# EAGLE design 2te40ut (EAGLE 4.16)
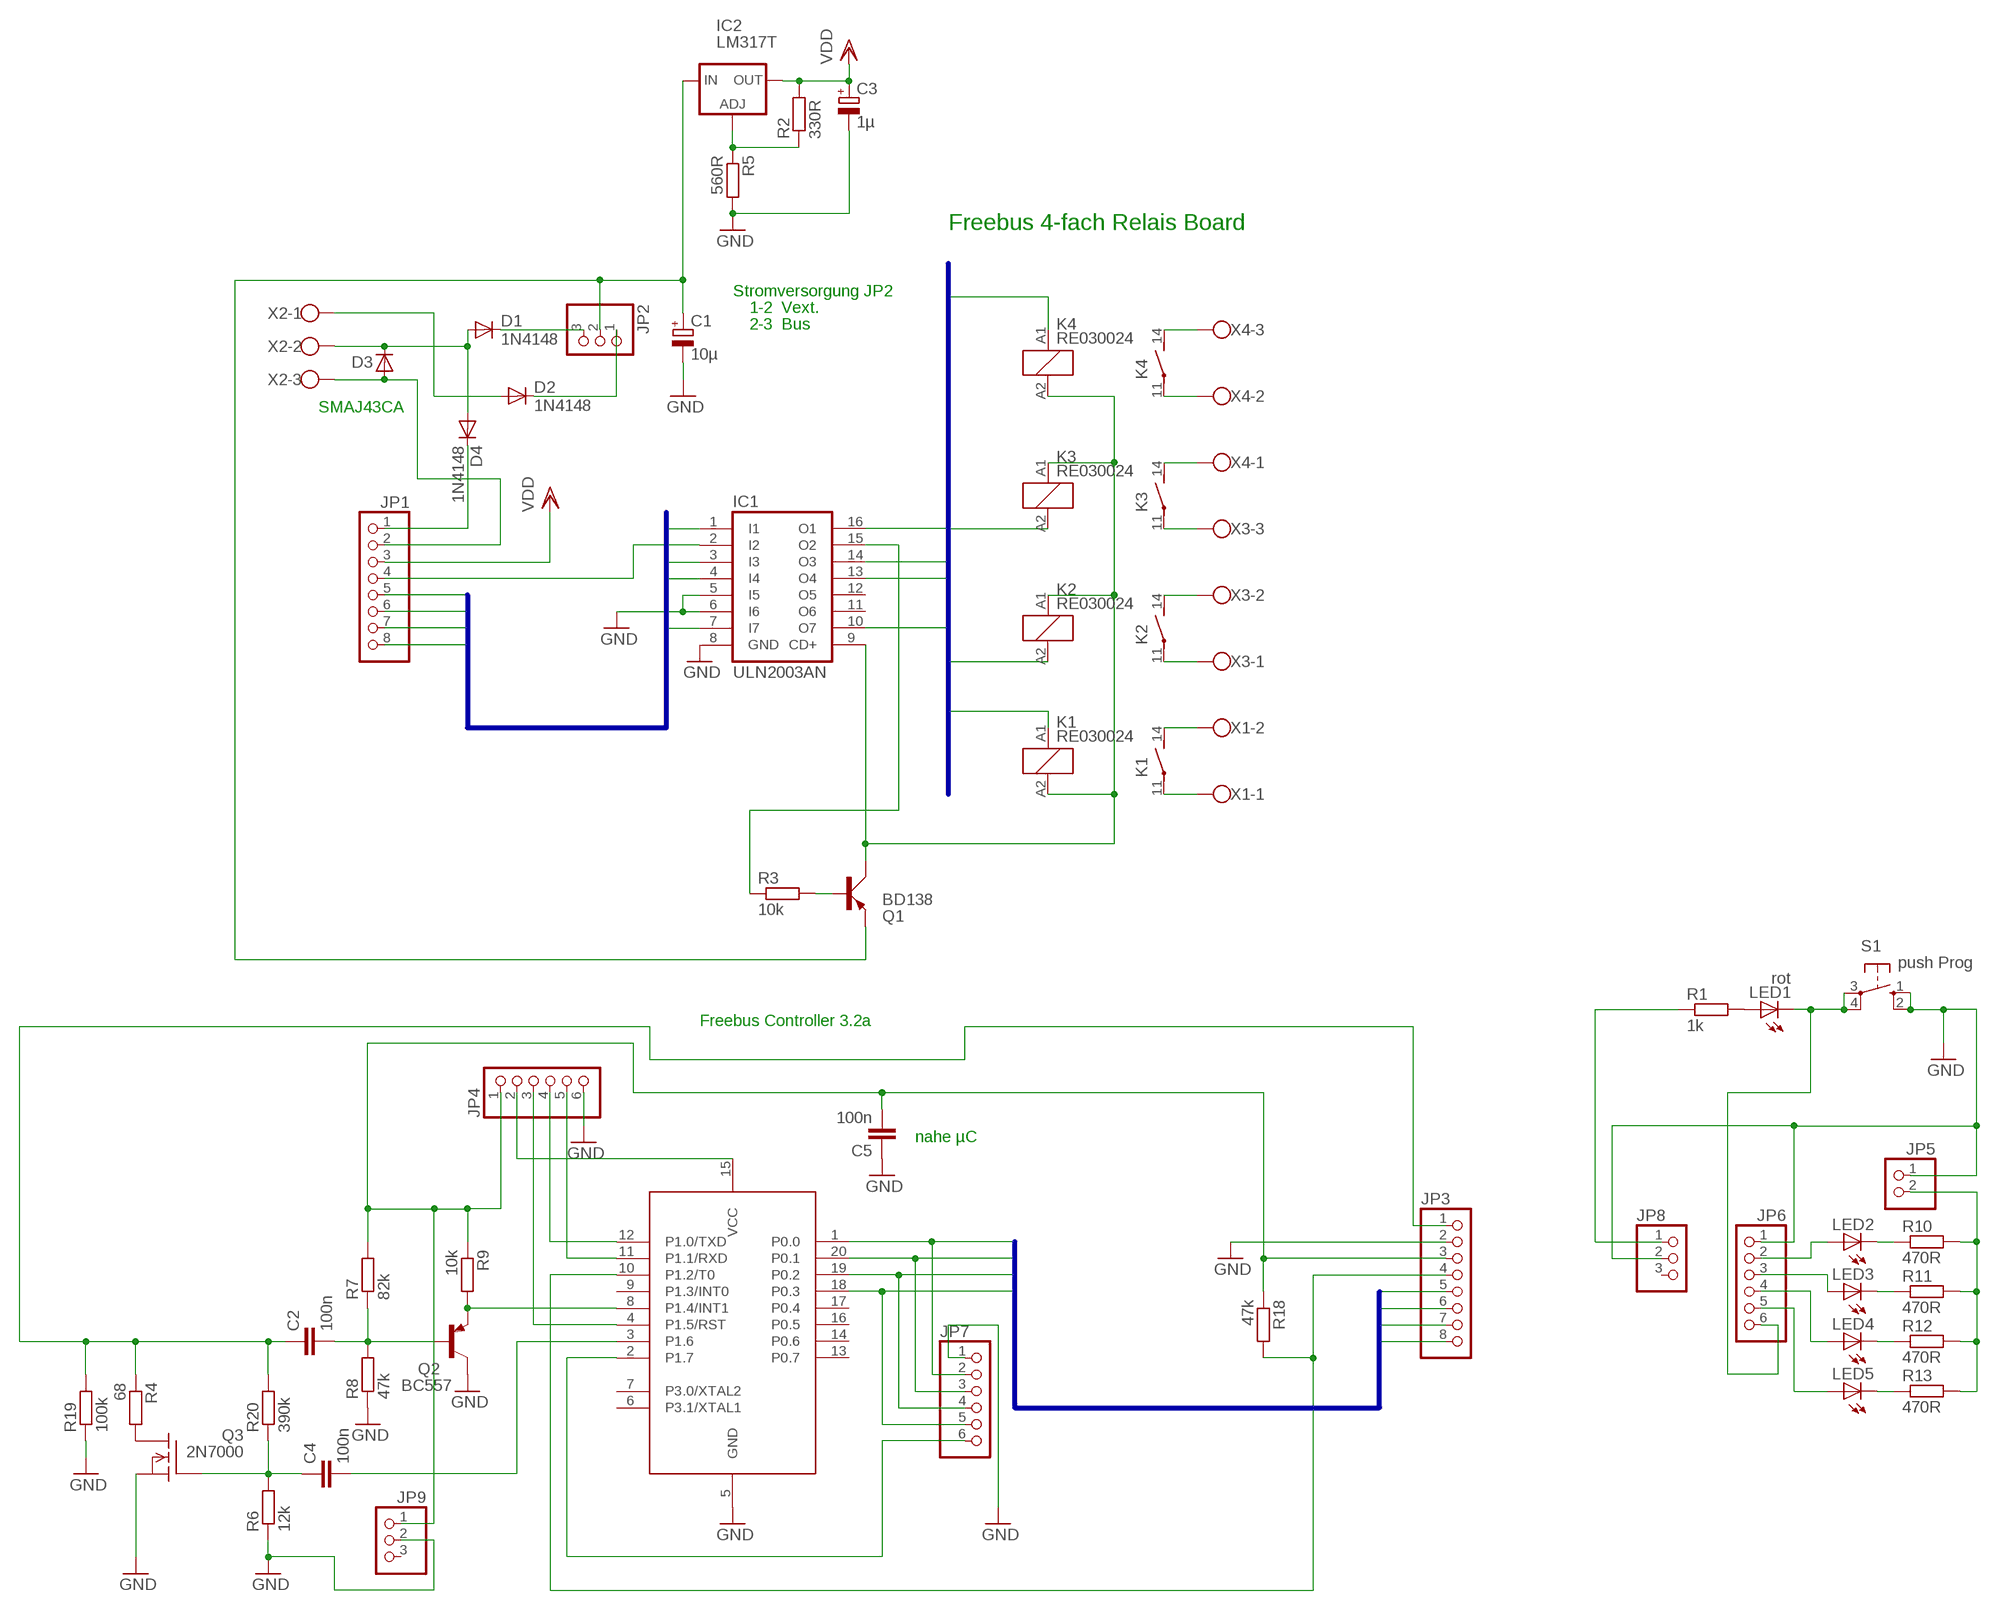
[diagram p0: schematic, sheet 1]

## Parts
C1  10µ  CPOL-EUE3.5-8  [E3,5-8]
C2  100n  C-EU050-024X044  [C050-024X044]
C3  1µ  CPOL-EUE2.5-5  [E2,5-5]
C4  100n  C-EU050-024X044  [C050-024X044]
C5  100n  C-EU050-024X044  [C050-024X044]
D1  1N4148  [DO35-10]
D2  1N4148  [DO35-10]
D3  D-  [SMA]
D4  1N4148  [DO35-10]
IC1  ULN2003AN  [DIL16]
IC2  LM317T  LM317L  [317L]
JP1  PINHD-1X8  [1X08]
JP2  PINHD-1X3  [1X03]
JP3  PINHD-1X8  [1X08]
JP4  PINHD-1X6  [1X06]
JP5  PINHD-1X2  [1X02]
JP6  PINHD-1X6  [1X06]
JP7  PINHD-1X6  [1X06]
JP8  PINHD-1X3  [1X03]
JP9  PINHD-1X3  [1X03]
K1  RE030024  [RE-SCHRACK]
K2  RE030024  [RE-SCHRACK]
K3  RE030024  [RE-SCHRACK]
K4  RE030024  [RE-SCHRACK]
LED1  rot  LED3MM  [LED3MM]
LED2  LED3MM  [LED3MM]
LED3  LED3MM  [LED3MM]
LED4  LED3MM  [LED3MM]
LED5  LED3MM  [LED3MM]
Q1  BD138  BD140  [TO126AV]
Q2  BC557  [TO92]
Q3  2N7000  VN2222KM  [TO237]
R1  1k  R-EU_0207/10  [0207/10]
R2  330R  R-EU_0207/10  [0207/10]
R3  10k  R-EU_0207/10  [0207/10]
R4  68  R-EU_0207/10  [0207/10]
R5  560R  R-EU_0207/10  [0207/10]
R6  12k  R-EU_0207/10  [0207/10]
R7  82k  R-EU_0207/10  [0207/10]
R8  47k  R-EU_0207/10  [0207/10]
R9  10k  R-EU_0207/10  [0207/10]
R10  470R  R-EU_0207/10  [0207/10]
R11  470R  R-EU_0207/10  [0207/10]
R12  470R  R-EU_0207/10  [0207/10]
R13  470R  R-EU_0207/10  [0207/10]
R18  47k  R-EU_0207/10  [0207/10]
R19  100k  R-EU_0207/10  [0207/10]
R20  390k  R-EU_0207/10  [0207/10]
S1  push Prog  10-XX  [B3F-10XX]
U1  89LPC922  [DIL20]
X1  W237-02P  [W237-132]
X2  W237-3E  [W237-3E]
X3  W237-3E  [W237-3E]
X4  W237-3E  [W237-3E]

## Nets
GND: C1.- C3.- C5.1 D3.2(A) IC1.5(I5) IC1.6(I6) IC1.8(GND) JP1.2 JP3.2 JP4.6 JP5.1 JP6.1 JP7.1 JP8.2 JP9.2 Q2.3(C) Q3.3(S) R5.2 R6.1 R8.1 R19.1 S1.1(S) S1.2(S1) U1.5(GND) X2.3
IO1: IC1.1(I1) JP1.5
IO2: IC1.7(I7) JP1.8
IO3: IC1.4(I4) JP1.7
IO4: IC1.3(I3) JP1.6
N$1: K1.11(2:P) X1.1
N$2: K1.14(2:S) X1.2
N$3: Q2.1(E) R9.2 U1.8(P1.4/INT1)
N$4: D1.A D3.1(C) D4.A X2.2
N$5: K2.11(2:P) X3.1
N$6: K2.14(2:S) X3.2
N$7: K3.11(2:P) X3.3
N$8: K3.14(2:S) X4.1
N$9: K4.11(2:P) X4.2
N$10: K4.14(2:S) X4.3
N$11: IC1.15(O2) R3.1
N$12: IC1.2(I2) JP1.4
N$13: C2.2 Q2.2(B) R7.1 R8.2
N$14: C4.2 U1.3(P1.6)
N$15: Q3.1(D) R4.2
N$16: IC2.1(ADJ) R2.1 R5.1
N$17: D2.A X2.1
N$18: C2.1 JP3.1 R4.1 R19.2 R20.2
N$19: IC1.9(CD+) K1.A2 K2.A1 K3.A1 K4.A2 Q1.C
N$20: JP5.2 R10.2 R11.2 R12.2 R13.2
N$21: C5.2 JP3.3 JP4.1 JP9.1 R7.2 R9.1 R18.1
N$22: JP6.6 LED1.K(C) S1.3(P) S1.4(P1)
N$23: LED2.K(C) R10.1
N$24: LED5.K(C) R13.1
N$25: JP4.3 U1.4(P1.5/RST)
N$26: JP4.2 U1.15(VCC)
N$27: LED4.K(C) R12.1
N$28: LED1.A R1.2
N$29: JP4.4 U1.12(P1.0/TXD)
N$30: JP4.5 U1.11(P1.1/RXD)
N$31: D2.C JP2.1
N$32: D1.C JP2.3
N$33: LED3.K(C) R11.1
N$34: JP6.2 LED2.A
N$35: JP6.3 LED3.A
N$36: JP6.4 LED4.A
N$37: Q1.B R3.2
N$38: JP6.5 LED5.A
N$39: JP8.1 R1.1
N$40: D4.C JP1.1
N$43: JP3.4 R18.2 U1.10(P1.2/T0)
N$44: C4.1 Q3.2(G) R6.2 R20.1
P0.0: JP3.5 JP7.2 U1.1(P0.0)
P0.1: JP3.8 JP7.3 U1.20(P0.1)
P0.2: JP3.7 JP7.4 U1.19(P0.2)
P0.3: JP3.6 JP7.5 U1.18(P0.3)
PGM: JP7.6 U1.2(P1.7)
R1: IC1.16(O1) K1.A1
R2: IC1.10(O7) K2.A2
R3: IC1.13(O4) K3.A2
R4: IC1.14(O3) K4.A1
VDD: C3.+ IC2.2(OUT) JP1.3 R2.2
VDD_IN: C1.+ IC2.3(IN) JP2.2 Q1.E
Unconnected: IC1.11(O6) IC1.12(O5) JP8.3 JP9.3 U1.6(P3.1/XTAL1) U1.7(P3.0/XTAL2) U1.9(P1.3/INT0) U1.13(P0.7) U1.14(P0.6) U1.16(P0.5) U1.17(P0.4)

## Buses
R[1..8]
IO[1..8]
P0.[0..7]

## Notes on the sheet
- Freebus 4-fach Relais Board
- Stromversorgung JP2
- 1-2  Vext.
- 2-3  Bus
- SMAJ43CA
- Freebus Controller 3.2a
- nahe µC

## Library data of the parts
C1 C3 = rcl:CPOL-EU: POLARIZED CAPACITOR, European symbol
C2 C4 C5 = rcl:C-EU: CAPACITOR, European symbol
D1 D2 D4 = diode:1N4148: DIODE high speed (Philips)
D3 = semicon-smd-ipc:D-: DIODE unfilled
IC1 = uln-udn:ULN2003A: DRIVER ARRAY
IC2 = v-reg:LM317L: VOLTAGE REGULATOR
JP1 JP3 = pinhead:PINHD-1X8: PIN HEADER
JP2 JP8 JP9 = pinhead:PINHD-1X3: PIN HEADER
JP4 JP6 JP7 = pinhead:PINHD-1X6: PIN HEADER
JP5 = pinhead:PINHD-1X2: PIN HEADER
K1-K4 = relay:RE03*: Miniature PCB Relay 1 pole 6 A SCHRACK Source: http://www.schrack.com/.. 5812.pdf
LED1-LED5 = led:LED: LED OSRAM: - CHIPLED LG R971, LG N971, LY N971, LG Q971, LY Q971, LO R971, LY R971 LH N974, LH R974 LS Q976, LO Q976, LY Q976 LO Q996 - Hyper CHIPLED LW Q18S LB Q993, LB Q99A, LB R99A - SideLED LS A670, LO A670, LY A670, LG A670, LP A670 LB A673, LV A673, LT A673, LW A673 LH A674 LY A675 LS A676, LA A676, LO A676, LY A676, LW A676 LS A679, LY A679, LG A679 - Hyper Micro SIDELED® LS Y876, LA Y876, LO Y876, LY Y876 LT Y87S - SmartLED LW L88C, LW L88S LB L89C, LB L89S, LG L890 LS L89K, LO L89K, LY L89K LS L896, LA L896, LO L896, LY L896 - TOPLED LS T670, LO T670, LY T670, LG T670, LP T670 LSG T670, LSP T670, LSY T670, LOP T670, LYG T670 LG T671, LOG T671, LSG T671 LB T673, LV T673, LT T673, LW T673 LH T674 LS T676, LA T676, LO T676, LY T676, LB T676, LH T676, LSB T676, LW T676 LB T67C, LV T67C, LT T67C, LS T67K, LO T67K, LY T67K, LW E67C LS E67B, LA E67B, LO E67B, LY E67B, LB E67C, LV E67C, LT E67C LW T67C LS T679, LY T679, LG T679 LS T770, LO T770, LY T770, LG T770, LP T770 LB T773, LV T773, LT T773, LW T773 LH T774 LS E675, LA E675, LY E675, LS T675 LS T776, LA T776, LO T776, LY T776, LB T776 LHGB T686 LT T68C, LB T68C - Hyper Mini TOPLED® LB M676 - Mini TOPLED Santana® LG M470 LS M47K, LO M47K, LY M47K Source: http://www.osram.convergy.de - LUMILED® LXK2-PW12-R00, LXK2-PW12-S00, LXK2-PW14-U00, LXK2-PW14-V00 LXK2-PM12-R00, LXK2-PM12-S00, LXK2-PM14-U00 LXK2-PE12-Q00, LXK2-PE12-R00, LXK2-PE12-S00, LXK2-PE14-T00, LXK2-PE14-U00 LXK2-PB12-K00, LXK2-PB12-L00, LXK2-PB12-M00, LXK2-PB14-N00, LXK2-PB14-P00, LXK2-PB14-Q00 LXK2-PR12-L00, LXK2-PR12-M00, LXK2-PR14-Q00, LXK2-PR14-R00 LXK2-PD12-Q00, LXK2-PD12-R00, LXK2-PD12-S00 LXK2-PH12-R00, LXK2-PH12-S00 LXK2-PL12-P00, LXK2-PL12-Q00, LXK2-PL12-R00 Source: www.luxeon.com
Q1 = transistor-power:BD140: PNP TRANSISTOR
Q2 = transistor-pnp:BC557: PNP Transistor
Q3 = transistor-fet:VN2222KM: N-Channel Enhancement MOSFET (VMOS); 60V; 0,5A; 7,5Ohm
R1-R13 R18-R20 = rcl:R-EU_: RESISTOR, European symbol
S1 = switch-omron:10-XX: OMRON SWITCH
U1 = micro-philips:89LPC922
X1 = con-wago-508:W237-02P: WAGO SREW CLAMP
X2-X4 = con-wago-508:W237-3E: WAGO SREW CLAMP

## Board
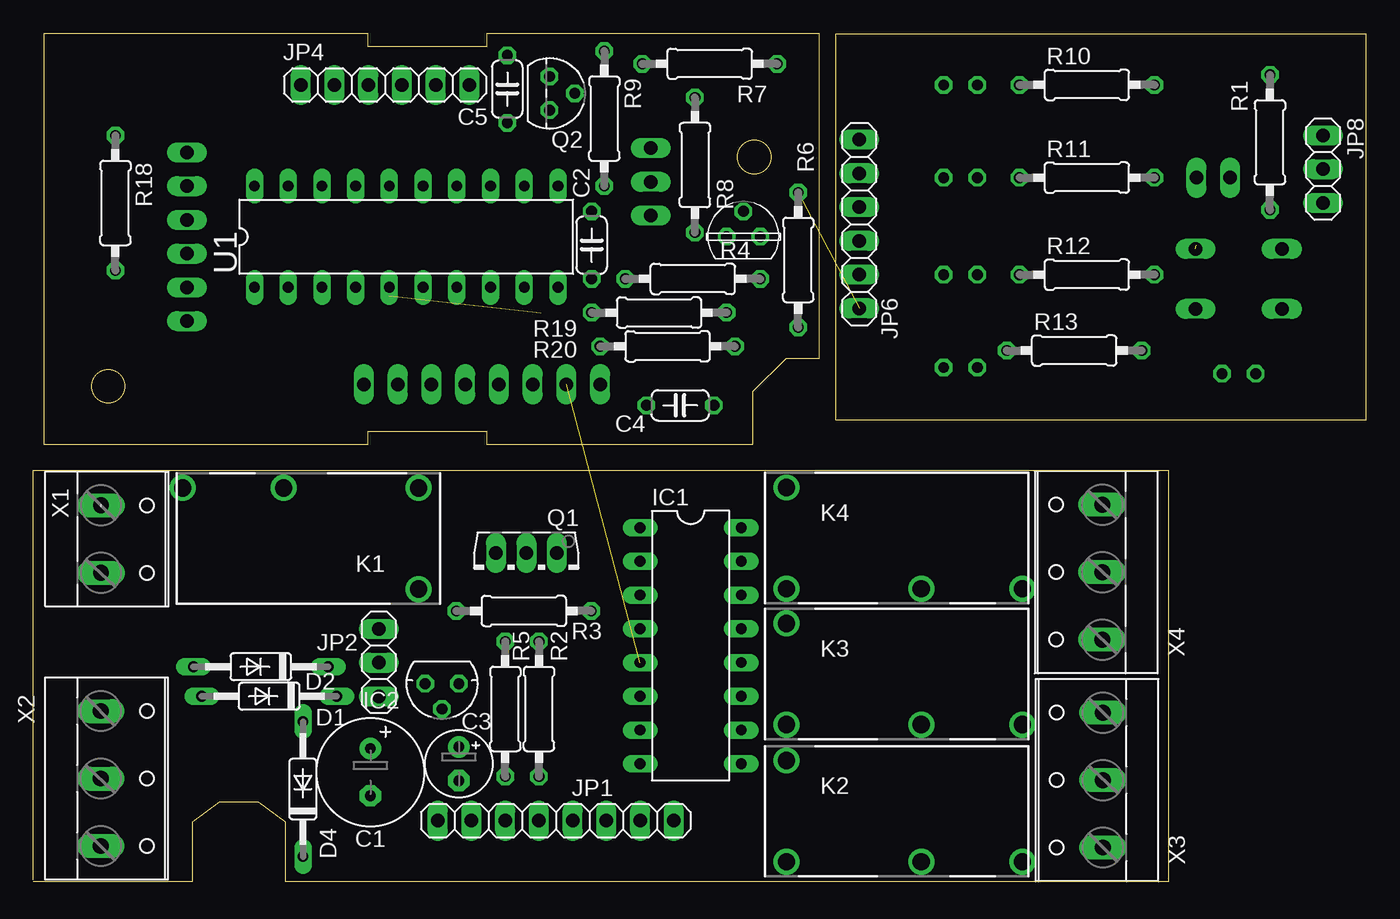
[diagram p1: board, top side]
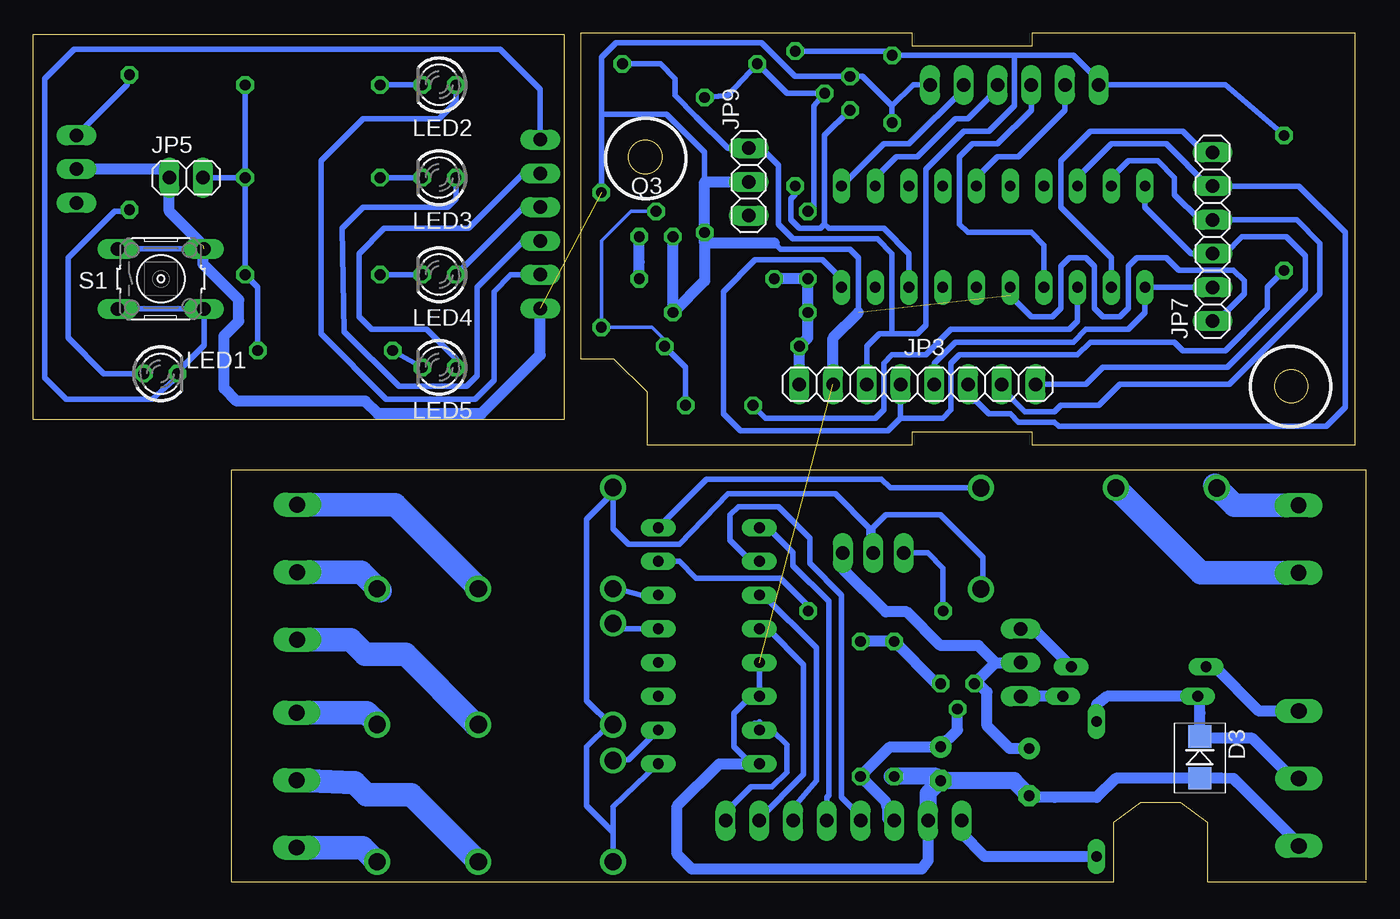
[diagram p2: board, bottom side, seen from below]

Size 100.42 x 63.9 mm. Coordinates in mm from the lower left corner, seen from the top.
Outline: 0.01,0.16 0.01,31 85.5,31 85.5,0 19,0 19,4.5 18.99,4.51 16.99,6.01 14.01,6.01 14.01,6 12,4.49 12,0 0,0
Outline: 59.2,39.4 56.7,39.4 54.2,36.9
Outline: 54.2,36.9 54.2,32.9 34.2,32.9 34.2,33.9
Outline: 34.2,33.9 25.2,33.9 25.2,32.9 0.83,32.9 0.83,63.9 25.2,63.9 25.2,62.9 34.2,62.9 34.2,63.9
Outline: 34.2,63.9 59.2,63.9 59.2,39.4
Outline: 100.42,34.78 100.42,63.82
Outline: 100.42,63.83 60.42,63.83
Outline: 60.42,63.82 60.42,34.78
Outline: 60.42,34.78 100.42,34.78
Outline: circle at 54.32,54.58 radius 1.26
Outline: circle at 5.65,37.32 radius 1.26
Copper layers (1*16): Top 0.035mm / dielectric 1.5mm / Bottom 0.035mm
Design rules "default": minimum track width 10mil, minimum drill 24mil, track to track 8mil, track to pad 8mil, pad to pad 8mil, via to via 8mil, smd to smd 8mil, copper to edge 40mil, drill to drill 8mil, minimum pad ring 10mil, minimum via ring 8mil, stop-mask expansion 4mil, vias tented up to drill 0mil, thermal gap 10mil

### Footprints (pad centres in the part's own frame; a part is rotated, then mirrored left to right if it is on the bottom)
E3,5-8 = drill 0.813 pad 1.6 round: + -1.778,0 | drill 0.813 pad 1.6 octagon: - 1.778,0
C050-024X044 = drill 0.813 octagon: 1 -2.54,0; 2 2.54,0
E2,5-5 = drill 0.813 pad 1.6 round: + -1.27,0 | drill 0.813 pad 1.6 octagon: - 1.27,0
DO35-10 = drill 0.813 long: A 5.08,0; C -5.08,0
SMA = smd 1.67 x 1.73: 1 -1.576,0; 2 1.58,0.014
DIL16 = drill 0.813 long: 1 -8.89,-3.81; 2 -6.35,-3.81; 3 -3.81,-3.81; 4 -1.27,-3.81; 5 1.27,-3.81; 6 3.81,-3.81; 7 6.35,-3.81; 8 8.89,-3.81; 9 8.89,3.81; 10 6.35,3.81; 11 3.81,3.81; 12 1.27,3.81; 13 -1.27,3.81; 14 -3.81,3.81; 15 -6.35,3.81; 16 -8.89,3.81
317L = drill 0.813 octagon: 1 -1.27,0; 2 0,1.905; 3 1.27,0
1X08 = drill 1.016 long: 1 -8.89,0; 2 -6.35,0; 3 -3.81,0; 4 -1.27,0; 5 1.27,0; 6 3.81,0; 7 6.35,0; 8 8.89,0
1X03 = drill 1.016 long: 1 -2.54,0; 2 0,0; 3 2.54,0
1X06 = drill 1.016 long: 1 -6.35,0; 2 -3.81,0; 3 -1.27,0; 4 1.27,0; 5 3.81,0; 6 6.35,0
1X02 = drill 1.016 long: 1 -1.27,0; 2 1.27,0
RE-SCHRACK = drill 1.3 round: 11 8.89,-3.81; 14 1.27,-3.81; A1 -8.89,-3.81; A2 -8.89,3.81
LED3MM = drill 0.813 octagon: A -1.27,0; K 1.27,0
TO126AV = drill 1.016 long: B 2.286,-1.27; C 0,-1.27; E -2.286,-1.27
TO92 = drill 0.813 octagon: 1 1.27,0; 2 0,1.905; 3 -1.27,0
TO237 = drill 0.813 octagon: 1 1.27,0; 2 0,1.905; 3 -1.27,0
0207/10 = drill 0.813 octagon: 1 -5.08,0; 2 5.08,0
B3F-10XX = drill 1.016 long: 1 -3.251,2.261; 2 3.251,2.261; 3 -3.251,-2.261; 4 3.251,-2.261
DIL20 = drill 0.813 long: 1 -11.43,-3.81; 2 -8.89,-3.81; 3 -6.35,-3.81; 4 -3.81,-3.81; 5 -1.27,-3.81; 6 1.27,-3.81; 7 3.81,-3.81; 8 6.35,-3.81; 9 8.89,-3.81; 10 11.43,-3.81; 11 11.43,3.81; 12 8.89,3.81; 13 6.35,3.81; 14 3.81,3.81; 15 1.27,3.81; 16 -1.27,3.81; 17 -3.81,3.81; 18 -6.35,3.81; 19 -8.89,3.81; 20 -11.43,3.81
W237-132 = drill 1.194 long: 1 -2.54,-0.635; 2 2.54,-0.635
W237-3E = drill 1.194 long: 1 -5.08,-0.635; 2 0,-0.635; 3 5.08,-0.635

### Placement (x,y rotation side)
C1  25.4,8.26 270 top
C2  42.07,47.94 90 top
C3  32.07,8.89 270 top
C4  48.74,35.88 180 top
C5  35.72,59.69 90 top
D1  17.78,13.97 180 top
D2  17.14,16.19 180 top
D3  12.54,9.37 270 bottom
D4  20.32,6.99 90 top
IC1  49.53,17.78 270 top
IC2  30.8,14.92 180 top
JP1  39.37,4.61 0 top
JP2  26.03,16.51 270 top
JP3  33.81,37.47 0 bottom
JP4  26.51,60.01 0 top
JP5  88.9,53.02 0 bottom
JP6  62.23,49.53 90 top
JP7  11.59,48.58 90 bottom
JP8  97.15,53.66 270 top
JP9  46.51,52.71 270 bottom
K1  20.14,25.85 180 top
K2  65.63,5.33 0 top
K3  65.62,15.65 0 top
K4  65.62,25.89 0 top
LED1  90.82,38.26 0 bottom
LED2  69.85,60.01 180 bottom
LED3  69.85,53.02 180 bottom
LED4  69.85,45.72 180 bottom
LED5  69.85,38.74 180 bottom
Q1  37.15,23.5 180 top
Q2  38.89,59.37 270 top
Q3  53.5,48.58 0 top
R1  93.16,55.69 270 top
R2  38.1,13.02 270 top
R3  36.96,20.4 180 top
R4  49.69,45.4 0 top
R5  35.56,13.02 270 top
R6  57.63,46.83 270 top
R7  50.96,61.6 0 top
R8  49.85,53.98 90 top
R9  43.02,57.47 270 top
R10  79.37,60.01 0 top
R11  79.37,53.02 0 top
R12  79.37,45.72 0 top
R13  78.42,40.01 0 top
R18  6.19,51.12 270 top
R19  47.15,42.86 180 top
R20  47.78,40.32 180 top
S1  90.8,45.4 0 bottom
U1  28.1,48.58 0 top
X1  5.74,25.81 270 top
X2  5.71,7.78 270 top
X3  79.94,7.66 90 top
X4  79.89,23.32 90 top

### Tracks (layer width: path | path; a pad name or v marks a point on that pad's centre or on a via)
GND  (4 unrouted)
  Bottom 0.406: 23.49,6.35 C1.- | IC1.5 IC1.6 46.35,13.97 47.62,12.7 47.62,10.16 46.35,8.89 | 35.72,58.42 37.94,60.64 Q2.3 43.02,60.64 45.56,63.18 56.51,63.18 57.62,62.07 57.62,57.79 | R6.1 57.62,57.95 57.62,57.79 | 57.62,57.79 52.7,57.79 50.96,56.04 49.85,54.93 R8.1 | U1.5 26.83,44.13 25.24,42.55 23.65,42.55 23.02,43.18 23.02,46.36 22.38,46.99 21.11,46.99 20.48,46.36 20.48,43.18 19.84,42.55 18.57,42.55 17.94,43.18 17.94,46.36 17.3,46.99 15.08,46.99 14.13,46.04 10,46.04 9.21,45.25 9.21,44.29 10.63,42.86 JP7.1 | S1.1 87.67,47.66 87.63,47.63 87.59,47.66 S1.2 | 35.72,58.42 C5.1 | 35.72,58.42 34.13,60.01 JP4.6 | 38.26,42.86 38.26,46.99 38.89,47.63 44.13,47.63 44.61,48.1
  Bottom 0.813: X2.3 5.08,2.86 9.21,6.99 | 9.21,6.99 10.01,7.79 | 25.08,6.35 23.49,6.35 20.32,6.35 18.88,7.79 D3.2 10.95,7.8 10,7.78 9.21,6.99 | IC1.8 46.35,8.89 48.73,8.89 51.91,5.72 51.91,2.07 50.8,0.95 33.5,0.95 33.02,1.59 JP1.2 | Q3.3 52.23,48.1 52.23,43.5 R19.1 49.85,45.25 49.85,48.1 | 49.85,48.1 R8.1 49.85,52.71 JP9.2 | JP6.1 62.23,39.69 66.67,35.24 74.45,35.24 75.41,36.2 85.09,36.2 86.04,37.15 86.04,41.12 84.93,42.23 84.93,43.82 87.63,46.52 87.63,47.63 | 87.63,47.95 90.17,50.48 JP5.1 90.8,53.66 JP8.2 | JP3.2 40.16,40.96 38.26,42.86 | 44.61,48.1 49.85,48.1
  Bottom 1.27: C1.- 26.54,7.62 C3.- | 35.72,7.94 R5.2 32.38,7.94 C3.- | JP1.2 | C3.- 33.02,6.67 JP1.2
IO1
  Bottom 0.406: IC1.1 45.08,26.67 43.18,24.77 43.18,23.81 40.48,21.12 40.48,6.51 40.64,6.35 JP1.5
IO2
  Bottom 0.406: 46.35,11.43 44.77,11.43 43.66,10.32 43.66,8.26 44.77,7.15 46.35,7.15 48.26,5.24 JP1.8 | 46.04,11.75 45.72,12.07
  Bottom 0.813: IC1.7 46.04,11.75 46.35,11.43
IO3
  Bottom 0.406: IC1.4 45.08,19.05 42.39,16.35 42.39,8.1 45.72,4.76 JP1.7
IO4
  Bottom 0.406: IC1.3 45.4,21.59 41.43,17.62 41.43,7.62 43.18,5.56 JP1.6
N$1
  Bottom 1.778: K1.11 11.43,29.85 | K1.11 | X1.1 9.94,28.35 K1.11
N$2
  Bottom 1.778: K1.14 18.86,29.66 12.48,23.27 X1.2
N$3
  Bottom 0.406: U1.8 34.45,47.31 36.35,49.21 40.48,49.21 40.8,49.53 | R9.2 43.02,51.75 43.34,51.44 43.34,49.85 42.7,49.21 41.12,49.21 40.8,49.53 | 40.8,49.53 40.8,56.2 Q2.1
N$4
  Bottom 0.813: X2.2 5.55,7.78 8.57,10.8 12.7,10.8 D3.1 12.54,12.7 12.54,13.65 arc-90 D1.A 19.52,13.97 20.32,13.34 D4.A
N$5
  Bottom 1.778: K2.11 74.54,1.52 75.6,2.58 X3.1
N$6
  Bottom 1.778: K2.14 66.92,1.52 71.95,6.55 75.28,6.55 76.2,7.46 X3.2
N$7
  Bottom 1.778: K3.11 74.52,11.97 75.29,12.74 X3.3
N$8
  Bottom 1.778: K3.14 67.08,11.84 72.37,17.13 75.41,17.15 76.5,18.24 X4.1
N$9
  Bottom 1.778: 74.46,22.08 74.29,21.91 | K4.11 74.46,22.08 | X4.2 75.7,23.32 74.46,22.08
N$10
  Bottom 1.778: K4.14 66.89,22.13 73.16,28.4 X4.3
N$11
  Bottom 0.406: 41.91,20.32 41.98,20.4 R3.1 41.67,20.4 44.13,22.86 50.48,22.86 51.75,24.13 IC1.15
N$12
  Bottom 0.406: IC1.2 46.35,24.13 47.94,25.72 47.94,27.62 47.31,28.26 44.29,28.26 41.91,25.88 41.91,23.97 39.53,21.59 39.53,6.35 38.58,5.4 JP1.4
N$13
  Bottom 0.406: C2.2 41.59,50.8 41.59,58.42 Q2.2 43.66,59.37 R7.1 48.1,59.22 R8.2
N$14
  Bottom 0.406: C4.2 45.24,34.93 36.99,34.93 36.35,35.56 36.35,39.05 35.72,39.69 33.18,39.69 31.27,41.59 22.38,41.59 21.75,42.23 U1.3
N$15
  Bottom 0.813: Q3.1 54.77,46.67 R4.2
N$16
  Bottom 0.813: IC2.1 32.38,14.92 R5.1 R2.1
N$17
  Bottom 0.813: X2.1 8.1,12.86 11.43,16.19 D2.A
N$18
  Bottom 0.813: R4.1 C2.1 R19.2 42.07,40.96 R20.2 JP3.1
N$19
  Bottom 0.406: 56.74,3.81 K2.A1 | 56.74,3.81 56.74,5.65 IC1.9 | 56.74,3.81 56.83,3.81 58.74,5.72 58.74,10.16 57.06,11.84 K3.A1 56.83,11.75 58.74,13.65 58.74,27.31 56.73,29.31 | 56.73,29.31 K4.A2 | 56.73,29.31 56.73,26.57 55.56,25.4 51.75,25.4 48.1,29.21 40,29.21 37.46,26.67 37.46,25.08 Q1.C 37.15,26.67 36.19,27.62 32.07,27.62 28.89,24.45 28.89,22.18 K1.A2
N$20
  Bottom 0.406: R11.2 R10.2 | R11.2 R12.2 83.5,44.77 R13.2 83.5,39.69 | R11.2 JP5.2
N$21
  Bottom 0.406: R18.1 10.63,60.01 JP4.1 20.16,60.33 22.06,62.23 26.51,62.23 | 35.72,41.28 36.67,41.28 37.62,40.32 JP3.3 | 26.51,62.23 C5.2 36.04,62.55 R9.1 | 26.51,62.23 26.51,58.42 28.41,56.52 30.32,56.52 33.18,53.66 33.18,41.91 33.81,41.28 35.72,41.28 | R7.2 53.18,61.6 52.07,60.49 52.07,59.22 50.48,57.63 48.1,55.25 JP9.1 45.56,55.25 44.29,53.98 44.29,49.53 43.18,48.42 36.83,48.42 35.72,47.31 35.72,41.28
N$22
  Bottom 0.406: JP6.6 62.23,59.69 65.24,62.71 97.31,62.71 99.53,60.49 99.53,37.94 97.95,36.36 91.44,36.36 89.85,37.78 89.53,38.1 89.55,38.12 LED1.K 89.55,38.4 87.55,40.4 S1.4 87.59,43.14 87.63,43.18 87.67,43.14 S1.3
N$23
  Bottom 0.406: LED2.K R10.1
N$24
  Bottom 0.406: R13.1 LED5.K
N$25
  Bottom 0.406: JP4.3 25.24,58.1 27.78,55.56 29.68,55.56 30.64,54.61 30.64,49.53 30,48.9 25.24,48.9 24.29,47.94 U1.4
N$26
  Bottom 0.406: U1.15 29.37,53.02 27.78,54.61 26.19,54.61 22.7,58.1 JP4.2
N$27
  Bottom 0.406: LED4.K R12.1
N$28
  Top 0.406: R1.2
  Bottom 0.406: LED1.A 95.09,38.27 97.79,40.96 97.79,46.99 94.3,50.48 93.03,50.48 R1.2
N$29
  Bottom 0.406: U1.12 36.99,53.02 35.4,54.61 33.81,54.61 30.95,57.47 30,57.47 27.78,59.69 JP4.4
N$30
  Bottom 0.406: U1.11 36.35,55.56 34.45,55.56 30.32,59.69 JP4.5
N$31
  Bottom 0.813: D2.C 25.08,19.05 JP2.1
N$32
  Bottom 0.813: D1.C JP2.3
N$33
  Bottom 0.406: LED3.K R11.1
N$34
  Bottom 0.406: JP6.2 64.45,45.72 65.72,44.45 65.72,37.78 67.15,36.36 73.82,36.36 78.74,41.28 78.74,54.29 75.56,57.47 69.85,57.47 68.58,58.74 LED2.A
N$35
  Bottom 0.406: JP6.3 63.5,48.26 66.99,44.77 66.99,38.1 67.78,37.31 72.86,37.31 76.99,41.44 77.15,49.21 75.56,50.8 69.21,50.8 68.58,51.44 LED3.A
N$36
  Bottom 0.406: JP6.4 63.5,50.8 LED4.A
N$37
  Bottom 0.406: R3.2 31.88,23.63 33.02,24.77 Q1.B 34.92,24.77
N$38
  Bottom 0.406: JP6.5 63.5,53.34 67.63,49.21 73.98,49.21 75.88,47.31 75.88,42.55 74.93,41.6 70.8,41.6 68.58,39.37 LED5.A
N$39
  Bottom 0.406: JP8.1 93.34,60.01 93.34,60.64 93.03,60.64 R1.1
N$40
  Bottom 0.813: D4.C 28.73,1.91 30.48,3.65 JP1.1 | JP1.1
N$43
  Bottom 0.406: 6.03,46.04 R18.2 7.46,44.77 7.46,43.18 9.21,41.44 | 9.21,41.44 | 9.21,41.44 10.63,40.01 13.81,40.01 14.45,40.64 20.79,40.64 21.75,39.69 30.64,39.69 31.27,39.05 31.27,35.56 31.91,34.93 35.08,34.93 | 35.08,34.93 JP3.4 | 35.08,34.93 35.56,34.45 36.04,33.97 36.19,33.97 47.15,33.97 48.42,35.24 48.42,44.45 46.04,46.83 44.45,46.83 44.13,46.83 40.96,46.83 39.53,45.4 U1.10
N$44
  Bottom 0.254: R20.1 52.86,40.8 53.82,41.75 R6.2 57.62,48.26 55.4,50.48 Q3.2
  Bottom 0.406: R20.1 51.28,38.74 C4.1
P0.0
  Bottom 0.406: JP7.2 U1.1 16.67,42.86 17.94,41.59 21.11,41.59 22.06,40.64 30.95,40.64 32.54,39.05 JP3.5
P0.1
  Bottom 0.406: U1.20 16.67,50.8 13.18,47.31 JP7.3 10.63,47.31 9.37,48.58 6.03,48.58 4.6,47.15 4.6,44.61 8.1,41.12 10.48,38.74 19.84,38.74 21.11,37.47 JP3.8
P0.2
  Bottom 0.406: JP3.7 27.46,37.15 25.72,35.4 23.49,35.4 23.02,35.88 20.16,35.88 18.57,37.47 10.32,37.47 6.98,40.8 3.49,44.29 3.49,48.1 5.24,49.85 JP7.4 12.54,49.85 14.45,51.75 14.45,53.02 15.71,54.29 17.94,54.29 19.21,53.02 U1.19
P0.3
  Bottom 0.406: U1.18 21.75,53.02 19.21,55.56 15.08,55.56 11.91,52.39 JP7.5 5.08,52.39 1.59,48.9 1.59,43.34 1.59,35.72 3.02,34.29 23.18,34.29 23.49,34.61 26.19,34.61 26.83,35.24 28.41,35.24 29.37,36.2 30,36.2 JP3.6
PGM
  Bottom 0.406: JP7.6 12.22,54.93 13.81,56.52 20.79,56.52 23.02,54.29 23.02,50.8 19.21,46.99 U1.2
R1
  Bottom 0.406: K1.A1 35.85,29.66 36.51,30.32 49.69,30.32 IC1.16
R2
  Bottom 0.406: K2.A2 56.76,9.14 56.83,9.21 55.56,9.21 IC1.10
R3
  Bottom 0.406: 56.73,19.59 56.83,19.69 | 56.73,19.59 K3.A2 | IC1.13 56.04,19.05 56.73,19.59
R4
  Bottom 0.406: IC1.14 54.61,21.59 55.88,21.91 56.51,21.91 56.73,22.13 | 56.73,22.13 56.83,22.23 | 56.73,22.13 K4.A1
VDD
  Bottom 0.813: IC2.2 30.8,11.43 C3.+ 35.88,10.16 R2.2 36.19,6.03 36.04,5.56 36.04,4.76 JP1.3
VDD_IN
  Bottom 0.813: 27.94,16.51 JP2.2 | 27.94,16.51 IC2.3 29.21,14.92 28.57,14.29 28.57,11.75 26.86,10.04 C1.+ | Q1.E 39.37,24.7 39.37,23.5 36.19,20.32 34.61,20.32 32.07,17.78 29.21,17.78 27.94,16.51